# EAGLE design untitled (EAGLE 5.09)
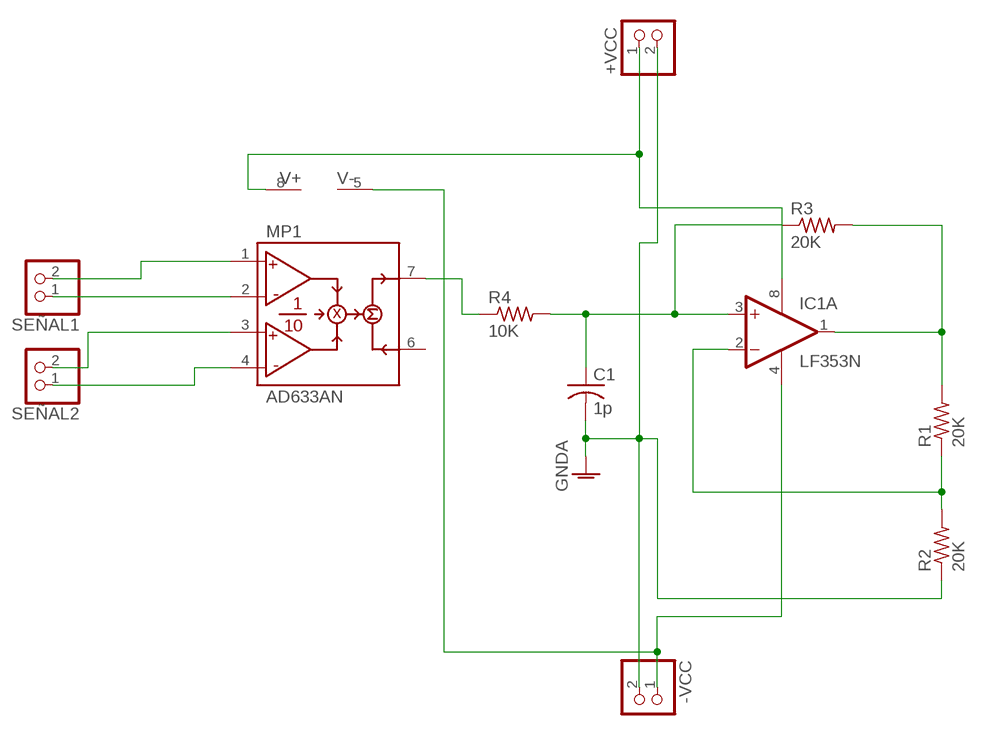
[diagram p0: schematic, sheet 1]

## Parts
+VCC  PINHD-1X2  [1X02]
-VCC  PINHD-1X2  [1X02]
C1  1p  C-US050-024X044  [C050-024X044]
IC1  LF353N  [DIL08]
MP1  AD633AN  [DIL08]
R1  20K  R-US_0204/7  [0204/7]
R2  20K  R-US_0204/7  [0204/7]
R3  20K  R-US_0204/7  [0204/7]
R4  10K  R-US_0204/7  [0204/7]
SEÑAL1  PINHD-1X2  [1X02]
SEÑAL2  PINHD-1X2  [1X02]

## Nets
GND: +VCC.2 -VCC.2 C1.2 R2.1 ; supply symbol labelled GNDA
N$1: MP1.7(W) R4.1
N$2: C1.1 IC1.3(A:+IN) R3.1 R4.2
N$3: IC1.1(A:OUT) R1.2 R3.2
N$4: IC1.2(A:-IN) R1.1 R2.2
N$5: +VCC.1 IC1.8(P:V+) MP1.8(V+)
N$6: -VCC.1 IC1.4(P:V-) MP1.5(V-)
N$7: MP1.1(X1) SEÑAL1.2
N$8: MP1.3(Y1) SEÑAL2.2
N$9: MP1.2(X2) SEÑAL1.1
N$10: MP1.4(Y2) SEÑAL2.1
Unconnected: IC1.5(B:+IN) IC1.6(B:-IN) IC1.7(B:OUT) MP1.6(Z)

## Library data of the parts
+VCC -VCC SEÑAL1 SEÑAL2 = pinhead:PINHD-1X2: PIN HEADER
C1 = rcl:C-US: CAPACITOR, American symbol
IC1 = linear:LF353: OP AMP
MP1 = ad633-2:AD633*
R1-R4 = rcl:R-US_: RESISTOR, American symbol

## Board
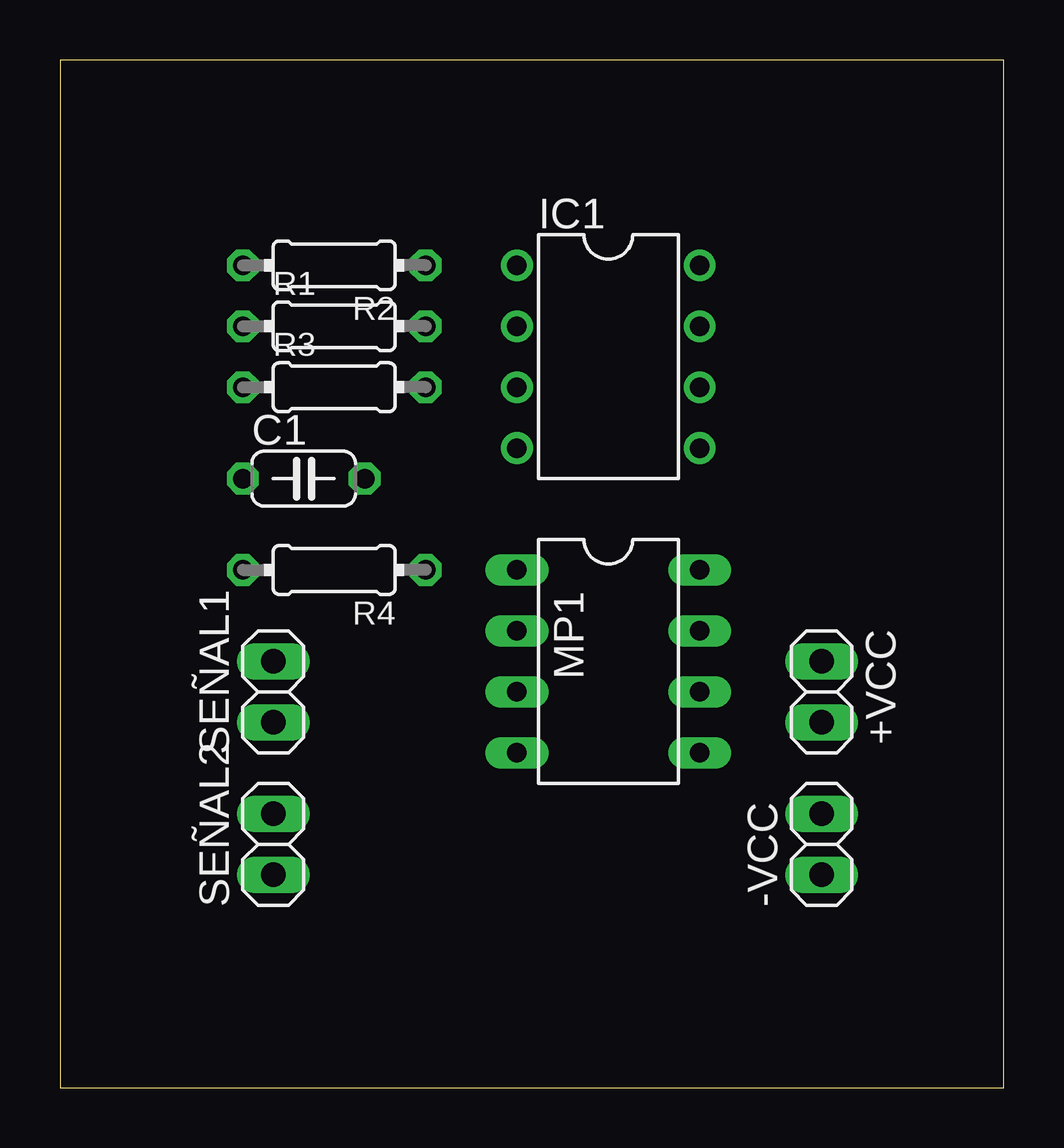
[diagram p1: board, top side]
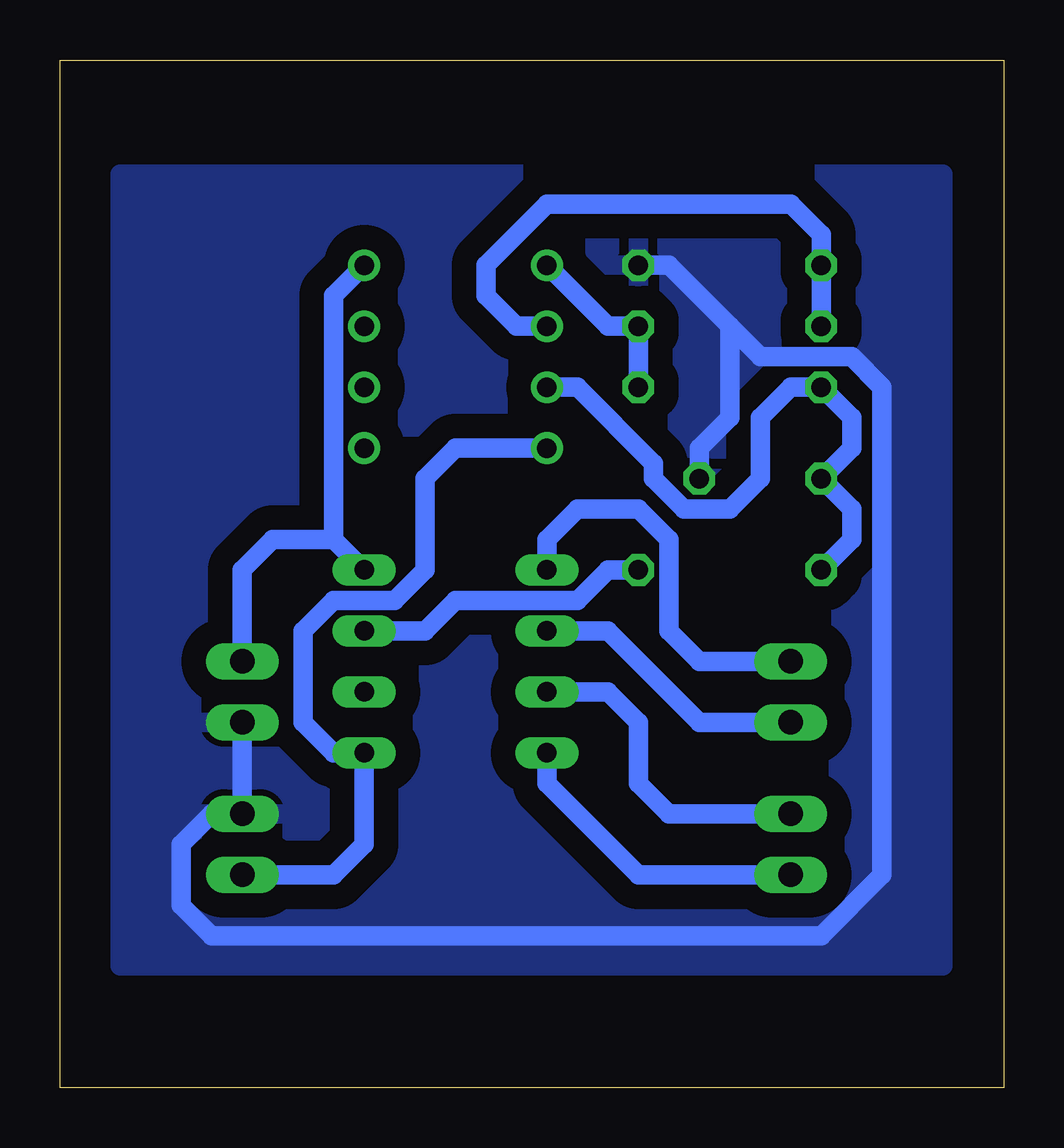
[diagram p2: board, bottom side, seen from below]

Size 39.35 x 42.85 mm. Coordinates in mm from the lower left corner, seen from the top.
Outline: 0,0 39.35,0 39.35,42.85 0,42.85 0,0
Copper layers (1*16): Top 0.035mm / dielectric 1.5mm / Bottom 0.035mm
Design rules "default": minimum track width 10mil, minimum drill 24mil, track to track 8mil, track to pad 8mil, pad to pad 8mil, via to via 8mil, smd to smd 8mil, copper to edge 40mil, drill to drill 8mil, minimum pad ring 10mil, minimum via ring 8mil, stop-mask expansion 4mil, vias tented up to drill 0mil, thermal gap 10mil

### Footprints (pad centres in the part's own frame; a part is rotated, then mirrored left to right if it is on the bottom)
1X02 = drill 1.016 long: 1 -1.27,0; 2 1.27,0
C050-024X044 = drill 0.813 octagon: 1 -2.54,0; 2 2.54,0
DIL08 = drill 0.813 pad 1.27 round: 1 -3.81,-3.81; 2 -1.27,-3.81; 3 1.27,-3.81; 4 3.81,-3.81; 5 3.81,3.81; 6 1.27,3.81; 7 -1.27,3.81; 8 -3.81,3.81
DIL08' = drill 0.813 long: 1 -3.81,-3.81; 2 -1.27,-3.81; 3 1.27,-3.81; 4 3.81,-3.81; 5 3.81,3.81; 6 1.27,3.81; 7 -1.27,3.81; 8 -3.81,3.81
0204/7 = drill 0.813 octagon: 1 -3.81,0; 2 3.81,0

### Placement (x,y rotation side)
+VCC  31.75,16.51 270 top
-VCC  31.75,10.16 90 top
C1  10.16,25.4 0 top
IC1  22.86,30.48 270 top
MP1  AD633AN  [DIL08']  22.86,17.78 270 top
R1  11.43,31.75 0 top
R2  11.43,34.29 180 top
R3  11.43,29.21 0 top
R4  11.43,21.59 180 top
SEÑAL1  8.89,16.51 90 top
SEÑAL2  8.89,10.16 90 top

### Tracks (layer width: path | path; a pad name or v marks a point on that pad's centre or on a via)
GND
  Bottom 0.813: C1.2 12.7,26.67 11.43,27.94 11.43,31.75 | 11.43,31.75 13.97,34.29 R2.1 | 11.43,31.75 10.16,30.48 6.35,30.48 5.08,29.21 5.08,8.89 7.62,6.35 33.02,6.35 34.29,7.62 34.29,10.16 33.02,11.43 -VCC.2 +VCC.2
  pour Bottom (isolate 1.016): 2.54,38.1 36.83,38.1 36.83,5.08 2.54,5.08
N$1
  Bottom 0.813: R4.1 16.51,21.59 17.78,20.32 22.86,20.32 24.13,19.05 MP1.7
N$2
  Bottom 0.813: R4.2 6.35,22.86 6.35,24.13 C1.1 6.35,26.67 6.35,27.94 R3.1 8.89,29.21 10.16,27.94 10.16,25.4 11.43,24.13 13.34,24.13 14.61,25.4 14.61,26.04 17.78,29.21 IC1.3
N$3
  Bottom 0.813: R3.2 R1.2 16.51,31.75 IC1.1
N$4
  Bottom 0.813: R1.1 R2.2 7.62,35.56 8.89,36.83 19.05,36.83 21.59,34.29 21.59,33.02 20.32,31.75 IC1.2
N$5
  Bottom 0.813: IC1.8 27.94,33.02 27.94,22.86 | MP1.8 27.94,22.86 | +VCC.1 31.75,21.59 30.48,22.86 27.94,22.86
N$6
  Bottom 0.813: -VCC.1 27.94,8.89 26.67,10.16 MP1.5 27.94,13.97 29.21,15.24 29.21,19.05 27.94,20.32 25.4,20.32 24.13,21.59 24.13,25.4 22.86,26.67 IC1.4
N$7
  Bottom 0.813: SEÑAL1.2 12.7,17.78 13.97,19.05 13.97,22.86 15.24,24.13 17.78,24.13 19.05,22.86 MP1.1
N$8
  Bottom 0.813: SEÑAL2.2 13.97,11.43 15.24,12.7 15.24,15.24 16.51,16.51 MP1.3
N$9
  Bottom 0.813: SEÑAL1.1 12.7,15.24 16.51,19.05 MP1.2
N$10
  Bottom 0.813: SEÑAL2.1 15.24,8.89 19.05,12.7 MP1.4